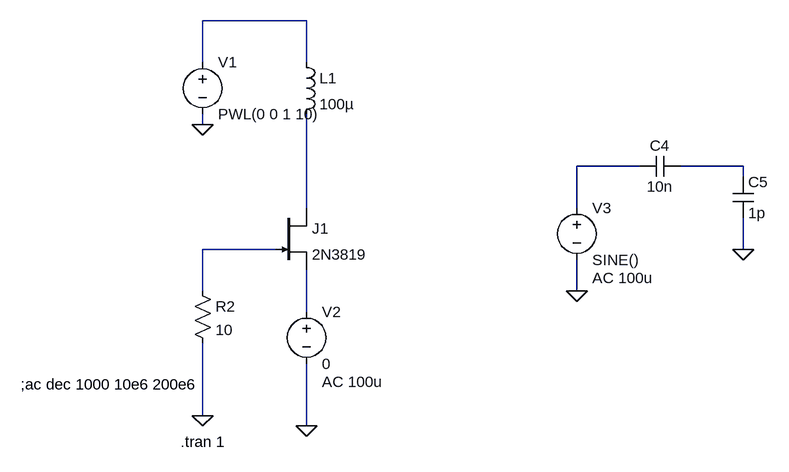
[diagram p0: schematic 2n3819.asc]
2n3819.asc, the LTspice schematic file:
Version 4
SHEET 1 880 680
WIRE 160 -224 0 -224
WIRE 0 -160 0 -224
WIRE 160 -160 160 -224
WIRE 0 -64 0 -80
WIRE 672 0 576 0
WIRE 832 0 736 0
WIRE 832 16 832 0
WIRE 160 64 160 -80
WIRE 576 64 576 0
WIRE 112 128 0 128
WIRE 832 128 832 80
WIRE 0 192 0 128
WIRE 576 192 576 144
WIRE 160 224 160 160
WIRE 0 384 0 272
WIRE 160 400 160 304
FLAG 0 384 0
FLAG 160 400 0
FLAG 0 -64 0
FLAG 576 192 0
FLAG 832 128 0
SYMBOL njf 112 64 R0
SYMATTR InstName J1
SYMATTR Value 2N3819
SYMBOL voltage 0 -176 R0
WINDOW 123 0 0 Left 0
WINDOW 39 0 0 Left 0
SYMATTR InstName V1
SYMATTR Value PWL(0 0 1 10)
SYMBOL res -16 176 R0
SYMATTR InstName R2
SYMATTR Value 10
SYMBOL ind 144 -176 R0
SYMATTR InstName L1
SYMATTR Value 100µ
SYMBOL voltage 160 208 R0
WINDOW 123 24 124 Left 2
WINDOW 39 0 0 Left 0
SYMATTR InstName V2
SYMATTR Value 0
SYMATTR Value2 AC 100u
SYMBOL cap 736 -16 R90
WINDOW 0 0 32 VBottom 2
WINDOW 3 32 32 VTop 2
SYMATTR InstName C4
SYMATTR Value 10n
SYMBOL voltage 576 48 R0
WINDOW 123 24 124 Left 2
WINDOW 39 0 0 Left 0
SYMATTR InstName V3
SYMATTR Value SINE()
SYMATTR Value2 AC 100u
SYMBOL cap 816 16 R0
SYMATTR InstName C5
SYMATTR Value 1p
TEXT -34 424 Left 2 !.tran 1
TEXT -280 336 Left 2 !;ac dec 1000 10e6 200e6

The netlist it stands for:
* 2n3819.asc
J1 N004 N005 N006 2N3819
V1 N001 0 PWL(0 0 1 10)
R2 N005 0 10
L1 N001 N004 100µ
V2 N006 0 0 AC 100u
C4 N003 N002 10n
V3 N002 0 SINE() AC 100u
C5 N003 0 1p
.model NJF NJF
.model PJF PJF
.lib standard.jft
.tran 1
;ac dec 1000 10e6 200e6
.backanno
.end